# EAGLE schematic board (EAGLE 7.7.0)
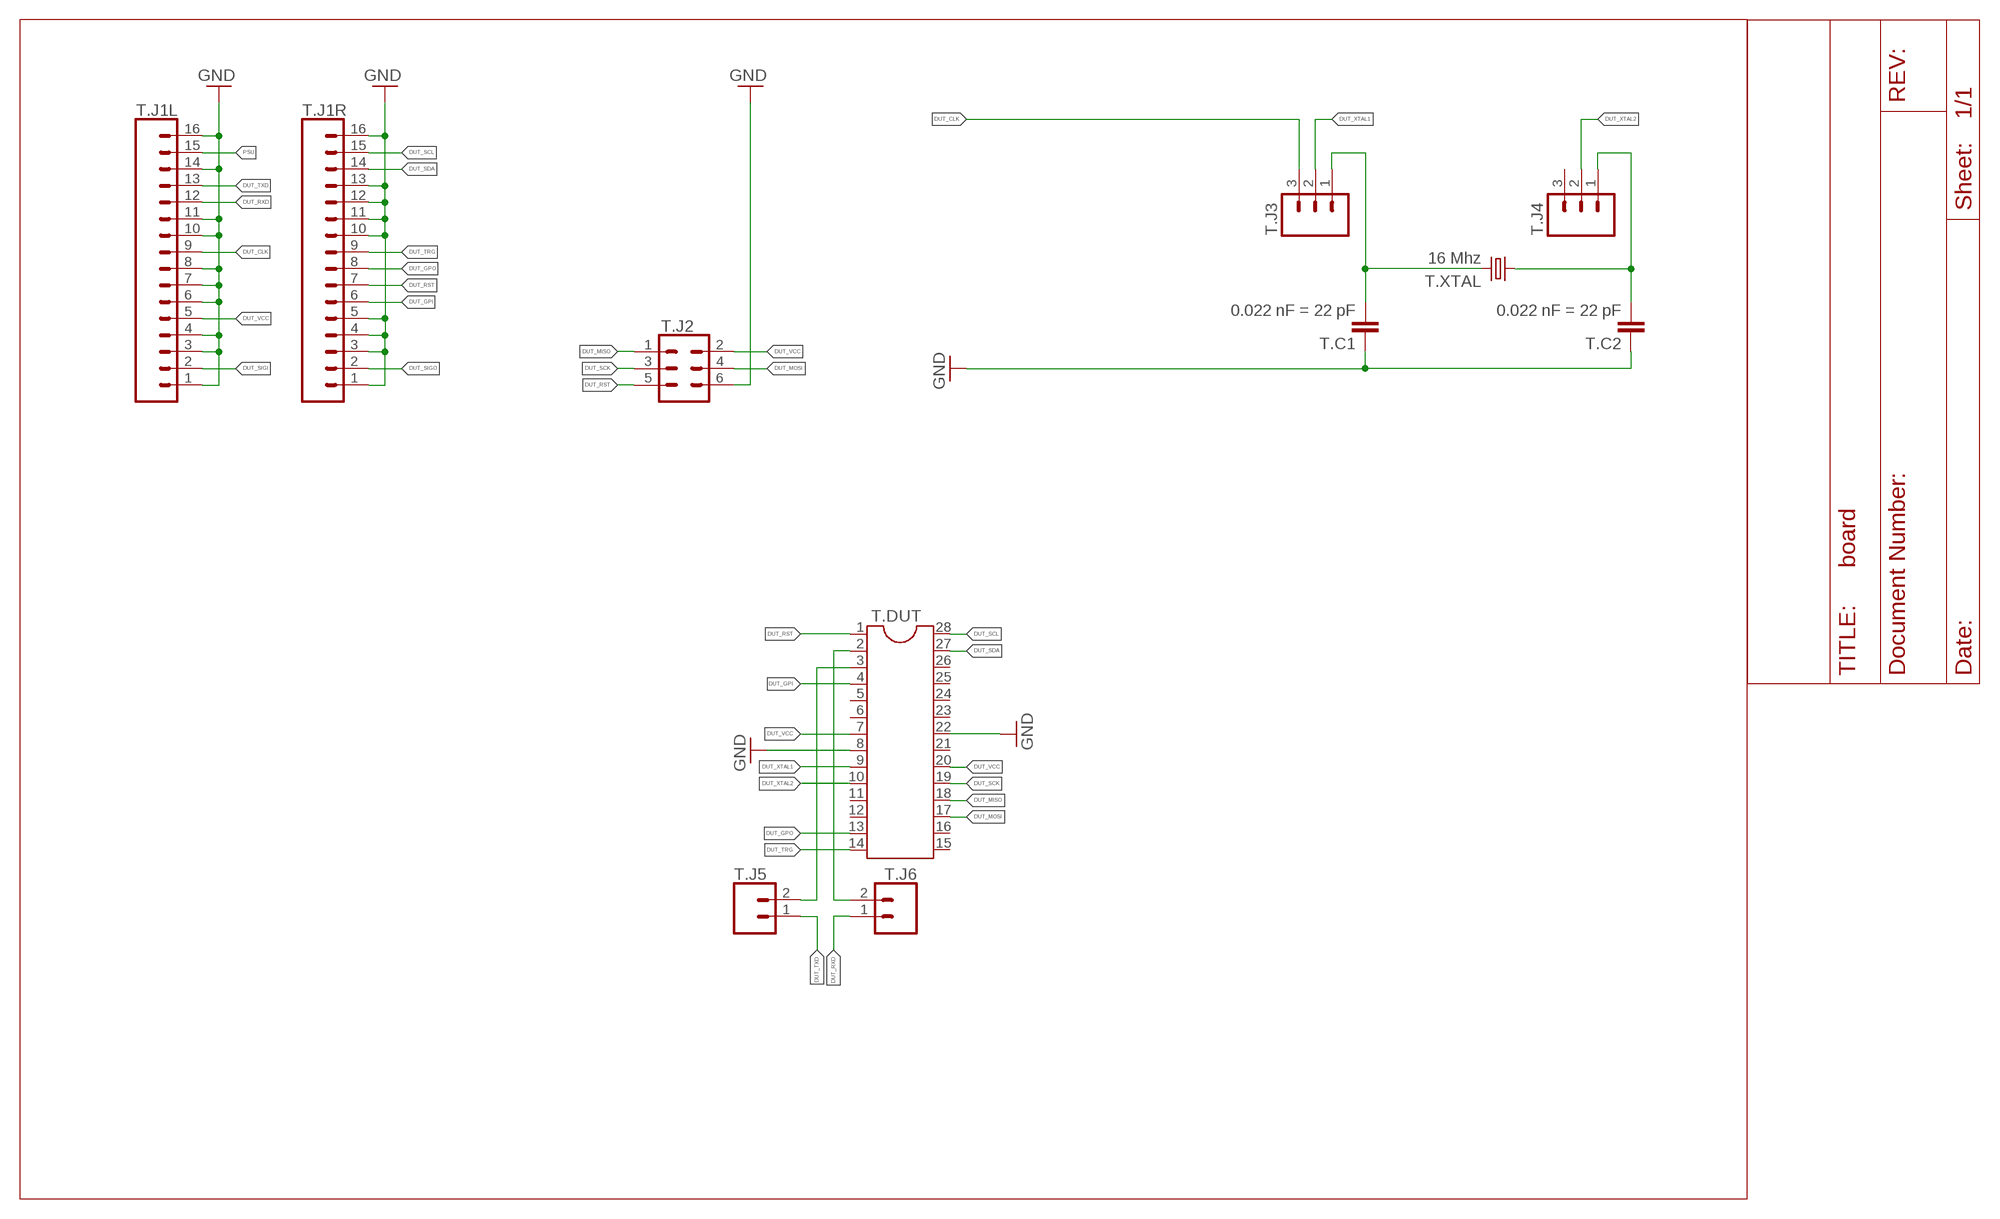
[diagram p0: schematic, sheet 1]

## Parts
T.C1  0.022 nF = 22 pF  CAP0603-CAP  [0603-CAP]
T.C2  0.022 nF = 22 pF  CAP0603-CAP  [0603-CAP]
T.DUT  DIL28-3  [DIL28-3]
T.J1L  CONN_16  [1X16]
T.J1R  CONN_16  [1X16]
T.J2  CONN_03X22X3_SILK_MALE_PTH  [2X3]
T.J3  M03PTH  [1X03]
T.J4  M03PTH  [1X03]
T.J5  CONN_02  [1X02]
T.J6  CONN_02  [1X02]
T.XTAL  16 Mhz  CRYSTALHC49US  [HC49US]

## Nets
DUT_CLK: T.J1L.9 T.J3.3
DUT_GPI: T.DUT.4 T.J1R.6
DUT_GPO: T.DUT.13 T.J1R.8
DUT_MISO: T.DUT.18 T.J2.1
DUT_MOSI: T.DUT.17 T.J2.4
DUT_RST: T.DUT.1 T.J1R.7 T.J2.5
DUT_RXD: T.J1L.12 T.J6.1
DUT_SCK: T.DUT.19 T.J2.3
DUT_SCL: T.DUT.28 T.J1R.15
DUT_SDA: T.DUT.27 T.J1R.14
DUT_SIGI: T.J1L.2
DUT_SIGO: T.J1R.2
DUT_TRG: T.DUT.14 T.J1R.9
DUT_TXD: T.J1L.13 T.J5.1
DUT_VCC: T.DUT.7 T.DUT.20 T.J1L.5 T.J2.2
DUT_XTAL1: T.DUT.9 T.J3.2
DUT_XTAL2: T.DUT.10 T.J4.2
GND: T.C1.1 T.C2.1 T.DUT.8 T.DUT.22 T.J1L.1 T.J1L.3 T.J1L.4 T.J1L.6 T.J1L.7 T.J1L.8 T.J1L.10 T.J1L.11 T.J1L.14 T.J1L.16 T.J1R.1 T.J1R.3 T.J1R.4 T.J1R.5 T.J1R.10 T.J1R.11 T.J1R.12 T.J1R.13 T.J1R.16 T.J2.6
N$1: T.C1.2 T.J3.1 T.XTAL.2
N$2: T.C2.2 T.J4.1 T.XTAL.1
N$3: T.DUT.3 T.J5.2
N$4: T.DUT.2 T.J6.2
PSU: T.J1L.15
Unconnected: T.DUT.5 T.DUT.6 T.DUT.11 T.DUT.12 T.DUT.15 T.DUT.16 T.DUT.21 T.DUT.23 T.DUT.24 T.DUT.25 T.DUT.26 T.J4.3

## Library data of the parts
T.C1 T.C2 = SparkFun-Capacitors:CAP: Capacitor Standard 0603 ceramic capacitor, and 0.1" leaded capacitor.
T.DUT = ic-package:DIL28: Dual In Line
T.J1L T.J1R = SparkFun-Connectors:CONN_16: Multi connection point. Often used as Generic Header-pin footprint for 0.1 inch spaced/style header connections On any of the 0.1 inch spaced packages, you can populate with these: Break Away Headers - Straight <https://www.sparkfun.com/products/116> (PRT-00116) Break Away Male Headers - Right Angle <https://www.sparkfun.com/products/553> (PRT-00553) Female Headers <https://www.sparkfun.com/products/115> (PRT-00115) Break Away Headers - Machine Pin <https://www.sparkfun.com/products/117> (PRT-00117) Break Away Female Headers - Swiss Machine Pin <https://www.sparkfun.com/products/743> (PRT-00743) For SCREWTERMINALS and SPRING TERMINALS visit here: Screw Terimnals on SparkFun.com <https://www.sparkfun.com/search/results?term=Screw+Terminals> (5mm/3.5mm/2.54mm spacing) This device is also useful as a general connection point to wire up your design to another part of your project. Our various solder wires solder well into these plated through hole pads. Hook-Up Wire - Assortment (Stranded, 22 AWG) <https://www.sparkfun.com/products/11375> (PRT-11375) Hook-Up Wire - Assortment (Solid Core, 22 AWG) <https://www.sparkfun.com/products/11367> (PRT-11367) View the entire wire category on our website here <https://www.sparkfun.com/categories/141> Special notes: Molex polarized connector foot print use with SKU : PRT-08231 with associated crimp pins and housings. 1MM SMD Version SKU: PRT-10208 NOTES ON THE VARIANTS LOCK and LOCK_LONGPADS... This footprint was designed to help hold the alignment of a through-hole component (i.e. 6-pin header) while soldering it into place. You may notice that each hole has been shifted either up or down by 0.005 of an inch from it's more standard position (which is a perfectly straight line). This slight alteration caused the pins (the squares in the middle) to touch the edges of the holes. Because they are alternating, it causes a "brace" to hold the component in place. 0.005 has proven to be the perfect amount of "off-center" position when using our standard breakaway headers. Although looks a little odd when you look at the bare footprint, once you have a header in there, the alteration is very hard to notice. Also,if you push a header all the way into place, it is covered up entirely on the bottom side.
T.J2 = SparkFun-Connectors:CONN_03X2: Multi connection point. Often used as Generic Header-pin footprint for 0.1 inch spaced/style header connections You can populate with any combo of single row headers, but if you'd like an exact match, check these: Header - 2x3 (Male, 0.1") <https://www.sparkfun.com/products/12807> (PRT-12807) Header - 2x3 (Female, 0.1") <https://www.sparkfun.com/products/13010> (PRT-13010) 2x3 Pin Shrouded Header <https://www.sparkfun.com/products/10877> (PRT-10877) On any of the 0.1 inch spaced packages, you can populate with these: Break Away Headers - Straight <https://www.sparkfun.com/products/116> (PRT-00116) Break Away Male Headers - Right Angle <https://www.sparkfun.com/products/553> (PRT-00553) Female Headers <https://www.sparkfun.com/products/115> (PRT-00115) Break Away Headers - Machine Pin <https://www.sparkfun.com/products/117> (PRT-00117) Break Away Female Headers - Swiss Machine Pin <https://www.sparkfun.com/products/743> (PRT-00743) Special note: the shrouded connector mates well with our 3x2 ribbon cables: Ribbon Crimp Connector - 6-pin (2x3, Female) <https://www.sparkfun.com/products/10651> (PRT-10651) Ribbon Cable - 6 wire (15ft) <https://www.sparkfun.com/products/10646> (PRT-10646); PROD_ID: CONN-09701
T.J3 T.J4 = SparkFun-Connectors:M03: Header 3 Standard 3-pin 0.1" header. Use with straight break away headers (SKU : PRT-00116), right angle break away headers (PRT-00553), swiss pins (PRT-00743), machine pins (PRT-00117), and female headers (PRT-00115). Molex polarized connector foot print use with SKU : PRT-08232 with associated crimp pins and housings.
T.J5 T.J6 = SparkFun-Connectors:CONN_02: Multi connection point. Often used as Generic Header-pin footprint for 0.1 inch spaced/style header connections On any of the 0.1 inch spaced packages, you can populate with these: Break Away Headers - Straight <https://www.sparkfun.com/products/116> (PRT-00116) Break Away Male Headers - Right Angle <https://www.sparkfun.com/products/553> (PRT-00553) Female Headers <https://www.sparkfun.com/products/115> (PRT-00115) Break Away Headers - Machine Pin <https://www.sparkfun.com/products/117> (PRT-00117) Break Away Female Headers - Swiss Machine Pin <https://www.sparkfun.com/products/743> (PRT-00743) For SCREWTERMINALS and SPRING TERMINALS visit here: Screw Terimnals on SparkFun.com <https://www.sparkfun.com/search/results?term=Screw+Terminals> (5mm/3.5mm/2.54mm spacing) This device is also useful as a general connection point to wire up your design to another part of your project. Our various solder wires solder well into these plated through hole pads. Hook-Up Wire - Assortment (Stranded, 22 AWG) <https://www.sparkfun.com/products/11375> (PRT-11375) Hook-Up Wire - Assortment (Solid Core, 22 AWG) <https://www.sparkfun.com/products/11367> (PRT-11367) View the entire wire category on our website here <https://www.sparkfun.com/categories/141> Special notes: Molex polarized connector foot print use with: PRT-08233 with associated crimp pins and housings. 2.54_SCREWTERM for use with PRT-10571. 3.5mm Screw Terminal footprints for PRT-08084 5mm Screw Terminal footprints for use with PRT-08432
T.XTAL = SparkFun-FreqCtrl:CRYSTAL: Various standard crystals. Proven footprints.